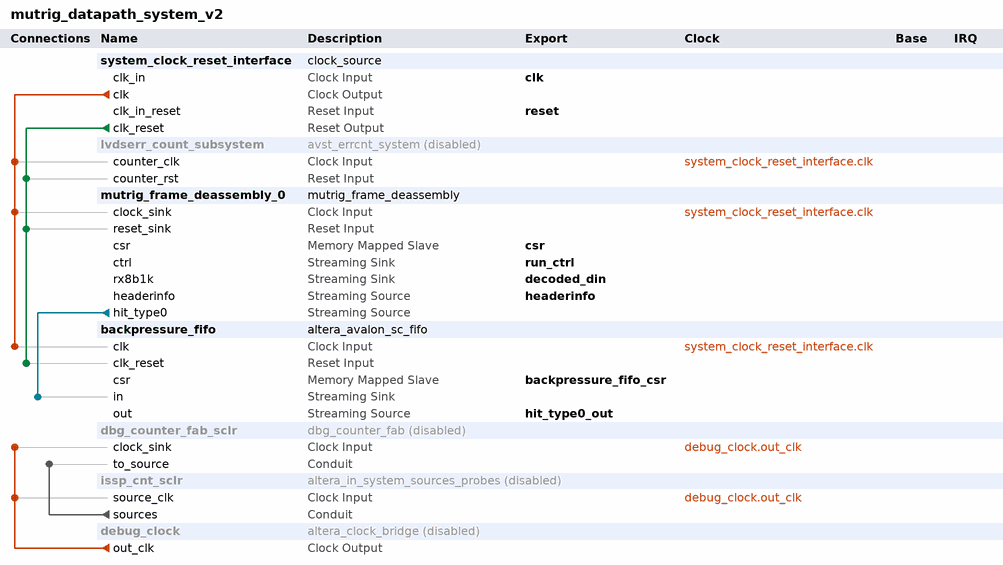
[diagram p0: system contents]
# Platform Designer (Qsys) system mutrig_datapath_system_v2, Arria V 5AGXBA7D4F31C5
# Parameters at their usual value, and those the tool derives, are not listed.
package require -exact qsys 18.1
create_system mutrig_datapath_system_v2
set_project_property DEVICE_FAMILY {Arria V}
set_project_property DEVICE 5AGXBA7D4F31C5

add_instance system_clock_reset_interface clock_source 18.1
set_instance_parameter_value system_clock_reset_interface clockFrequency 125000000
set_instance_parameter_value system_clock_reset_interface resetSynchronousEdges DEASSERT

add_instance lvdserr_count_subsystem avst_errcnt_system 1.0
set_instance_property lvdserr_count_subsystem ENABLED false

add_instance mutrig_frame_deassembly_0 mutrig_frame_deassembly 24.0.1021
set_instance_parameter_value mutrig_frame_deassembly_0 CHANNEL_WIDTH 4
set_instance_parameter_value mutrig_frame_deassembly_0 CSR_ADDR_WIDTH 2
set_instance_parameter_value mutrig_frame_deassembly_0 DEBUG_LV 0
set_instance_parameter_value mutrig_frame_deassembly_0 MODE_HALT 0

add_instance backpressure_fifo altera_avalon_sc_fifo 18.1
set_instance_parameter_value backpressure_fifo BITS_PER_SYMBOL 45
set_instance_parameter_value backpressure_fifo CHANNEL_WIDTH 4
set_instance_parameter_value backpressure_fifo ENABLE_EXPLICIT_MAXCHANNEL true
set_instance_parameter_value backpressure_fifo ERROR_WIDTH 3
set_instance_parameter_value backpressure_fifo EXPLICIT_MAXCHANNEL 15
set_instance_parameter_value backpressure_fifo FIFO_DEPTH 128
set_instance_parameter_value backpressure_fifo USE_ALMOST_EMPTY_IF 1
set_instance_parameter_value backpressure_fifo USE_FILL_LEVEL 1
set_instance_parameter_value backpressure_fifo USE_MEMORY_BLOCKS 1
set_instance_parameter_value backpressure_fifo USE_PACKETS 1
set_instance_parameter_value backpressure_fifo USE_STORE_FORWARD 0

add_instance dbg_counter_fab_sclr dbg_counter_fab 1.0.1
set_instance_property dbg_counter_fab_sclr ENABLED false

add_instance issp_cnt_sclr altera_in_system_sources_probes 18.1
set_instance_property issp_cnt_sclr ENABLED false
set_instance_parameter_value issp_cnt_sclr create_source_clock true
set_instance_parameter_value issp_cnt_sclr instance_id NONE
set_instance_parameter_value issp_cnt_sclr probe_width 0
set_instance_parameter_value issp_cnt_sclr sld_instance_index 10
set_instance_parameter_value issp_cnt_sclr source_width 2

add_instance debug_clock altera_clock_bridge 18.1
set_instance_property debug_clock ENABLED false
set_instance_parameter_value debug_clock DERIVED_CLOCK_RATE 0
set_instance_parameter_value debug_clock EXPLICIT_CLOCK_RATE 125000000

# connections
add_connection debug_clock.out_clk dbg_counter_fab_sclr.clock_sink clock
add_connection debug_clock.out_clk issp_cnt_sclr.source_clk clock
add_connection system_clock_reset_interface.clk backpressure_fifo.clk clock
add_connection system_clock_reset_interface.clk lvdserr_count_subsystem.counter_clk clock
add_connection system_clock_reset_interface.clk mutrig_frame_deassembly_0.clock_sink clock
add_connection system_clock_reset_interface.clk_reset backpressure_fifo.clk_reset reset
add_connection system_clock_reset_interface.clk_reset lvdserr_count_subsystem.counter_rst reset
add_connection system_clock_reset_interface.clk_reset mutrig_frame_deassembly_0.reset_sink reset
add_connection mutrig_frame_deassembly_0.hit_type0 backpressure_fifo.in avalon_streaming
add_connection issp_cnt_sclr.sources dbg_counter_fab_sclr.to_source conduit

# exported interfaces
add_interface backpressure_fifo_csr avalon slave
set_interface_property backpressure_fifo_csr EXPORT_OF backpressure_fifo.csr
add_interface clk clock sink
set_interface_property clk EXPORT_OF system_clock_reset_interface.clk_in
add_interface csr avalon slave
set_interface_property csr EXPORT_OF mutrig_frame_deassembly_0.csr
add_interface decoded_din avalon_streaming sink
set_interface_property decoded_din EXPORT_OF mutrig_frame_deassembly_0.rx8b1k
add_interface headerinfo avalon_streaming source
set_interface_property headerinfo EXPORT_OF mutrig_frame_deassembly_0.headerinfo
add_interface hit_type0_out avalon_streaming source
set_interface_property hit_type0_out EXPORT_OF backpressure_fifo.out
add_interface reset reset sink
set_interface_property reset EXPORT_OF system_clock_reset_interface.clk_in_reset
add_interface run_ctrl avalon_streaming sink
set_interface_property run_ctrl EXPORT_OF mutrig_frame_deassembly_0.ctrl

set_interconnect_requirement {$system} qsys_mm.clockCrossingAdapter HANDSHAKE
set_interconnect_requirement {$system} qsys_mm.enableEccProtection FALSE
set_interconnect_requirement {$system} qsys_mm.insertDefaultSlave FALSE
set_interconnect_requirement {$system} qsys_mm.maxAdditionalLatency 1

save_system mutrig_datapath_system_v2.qsys
